# Altium schematic sheet CTRL_Connectors.SchDoc
size A4; SheetNumber: 4; SheetTotal: 15
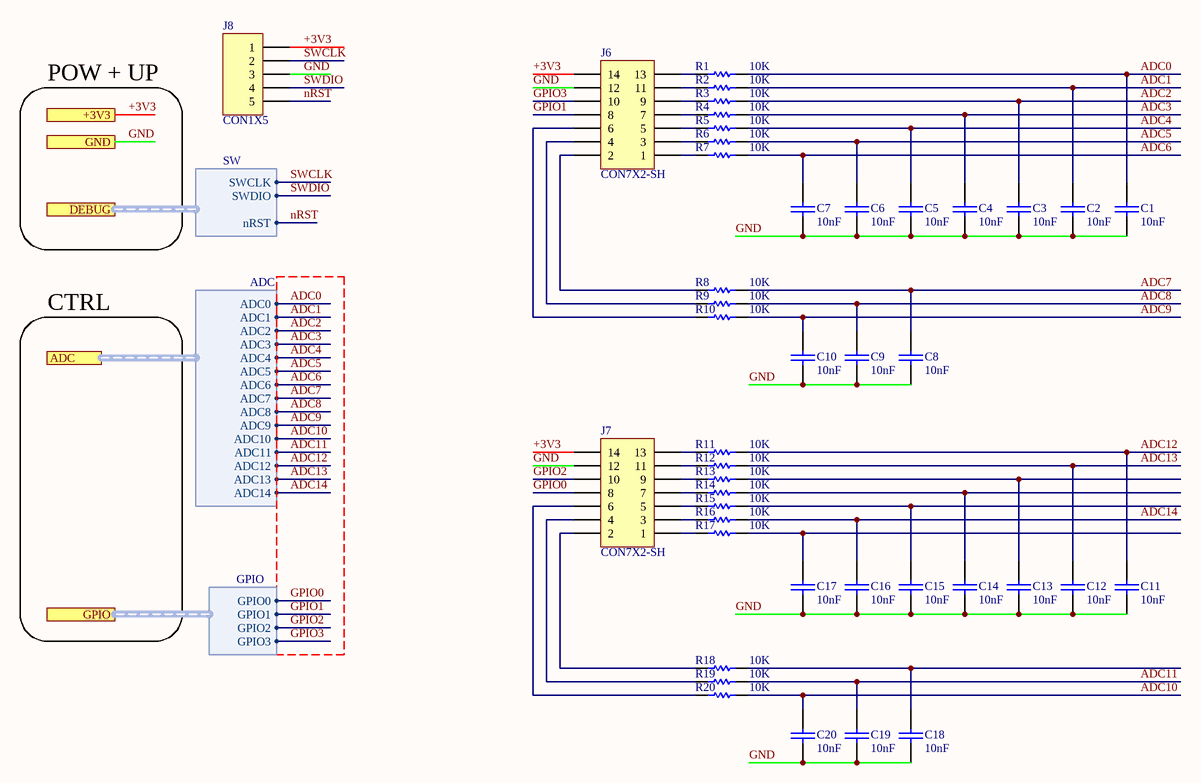
[diagram p0: CTRL_Connectors.SchDoc]

## Parts
C1  10nF  [0402-CAP-TDK]
C2  10nF  [0402-CAP-TDK]
C3  10nF  [0402-CAP-TDK]
C4  10nF  [0402-CAP-TDK]
C5  10nF  [0402-CAP-TDK]
C6  10nF  [0402-CAP-TDK]
C7  10nF  [0402-CAP-TDK]
C8  10nF  [0402-CAP-TDK]
C9  10nF  [0402-CAP-TDK]
C10  10nF  [0402-CAP-TDK]
C11  10nF  [0402-CAP-TDK]
C12  10nF  [0402-CAP-TDK]
C13  10nF  [0402-CAP-TDK]
C14  10nF  [0402-CAP-TDK]
C15  10nF  [0402-CAP-TDK]
C16  10nF  [0402-CAP-TDK]
C17  10nF  [0402-CAP-TDK]
C18  10nF  [0402-CAP-TDK]
C19  10nF  [0402-CAP-TDK]
C20  10nF  [0402-CAP-TDK]
J6  CON7X2-SH  [SIP7X2-SH]
J7  CON7X2-SH  [SIP7X2-SH]
J8  CON1X5  [SIP1X5]
R1  10K  [0402-RES-PANASONIC]
R2  10K  [0402-RES-PANASONIC]
R3  10K  [0402-RES-PANASONIC]
R4  10K  [0402-RES-PANASONIC]
R5  10K  [0402-RES-PANASONIC]
R6  10K  [0402-RES-PANASONIC]
R7  10K  [0402-RES-PANASONIC]
R8  10K  [0402-RES-PANASONIC]
R9  10K  [0402-RES-PANASONIC]
R10  10K  [0402-RES-PANASONIC]
R11  10K  [0402-RES-PANASONIC]
R12  10K  [0402-RES-PANASONIC]
R13  10K  [0402-RES-PANASONIC]
R14  10K  [0402-RES-PANASONIC]
R15  10K  [0402-RES-PANASONIC]
R16  10K  [0402-RES-PANASONIC]
R17  10K  [0402-RES-PANASONIC]
R18  10K  [0402-RES-PANASONIC]
R19  10K  [0402-RES-PANASONIC]
R20  10K  [0402-RES-PANASONIC]

## Ports
+3V3, ADC (harness ADC), DEBUG (harness SW), GND, GPIO (harness GPIO)

## Harnesses
SW: SWCLK, SWDIO, nRST
ADC: ADC0, ADC1, ADC2, ADC3, ADC4, ADC5, ADC6, ADC7, ADC8, ADC9, ADC10, ADC11, ADC12, ADC13, ADC14
GPIO: GPIO0, GPIO1, GPIO2, GPIO3

## Nets
+3V3: J6.14 J7.14 J8.1 ; port +3V3
ADC0: C1.2 R1.2 ; port ADC.ADC0
ADC1: C2.2 R2.2 ; port ADC.ADC1
ADC2: C3.2 R3.2 ; port ADC.ADC2
ADC3: C4.2 R4.2 ; port ADC.ADC3
ADC4: C5.2 R5.2 ; port ADC.ADC4
ADC5: C6.2 R6.2 ; port ADC.ADC5
ADC6: C7.2 R7.2 ; port ADC.ADC6
ADC7: C8.2 R8.2 ; port ADC.ADC7
ADC8: C9.2 R9.2 ; port ADC.ADC8
ADC9: C10.2 R10.2 ; port ADC.ADC9
ADC10: C20.2 R20.2 ; port ADC.ADC10
ADC11: C19.2 R19.2 ; port ADC.ADC11
ADC12: C11.2 R11.2 ; port ADC.ADC12
ADC13: C12.2 R12.2 ; port ADC.ADC13
ADC14: C16.2 R16.2 ; port ADC.ADC14
GND: C1.1 C2.1 C3.1 C4.1 C5.1 C6.1 C7.1 C8.1 C9.1 C10.1 C11.1 C12.1 C13.1 C14.1 C15.1 C16.1 C17.1 C18.1 C19.1 C20.1 J6.12 J7.12 J8.3 ; port GND
GPIO0: J7.8 ; port GPIO.GPIO0
GPIO1: J6.8 ; port GPIO.GPIO1
GPIO2: J7.10 ; port GPIO.GPIO2
GPIO3: J6.10 ; port GPIO.GPIO3
nRST: J8.5 ; port DEBUG.nRST
SWCLK: J8.2 ; port DEBUG.SWCLK
SWDIO: J8.4 ; port DEBUG.SWDIO
NetC13_2: C13.2 R13.2
NetC14_2: C14.2 R14.2
NetC15_2: C15.2 R15.2
NetC17_2: C17.2 R17.2
NetC18_2: C18.2 R18.2
NetJ6_1: J6.1 R7.1
NetJ6_2: J6.2 R8.1
NetJ6_3: J6.3 R6.1
NetJ6_4: J6.4 R9.1
NetJ6_5: J6.5 R5.1
NetJ6_6: J6.6 R10.1
NetJ6_7: J6.7 R4.1
NetJ6_9: J6.9 R3.1
NetJ6_11: J6.11 R2.1
NetJ6_13: J6.13 R1.1
NetJ7_1: J7.1 R17.1
NetJ7_2: J7.2 R18.1
NetJ7_3: J7.3 R16.1
NetJ7_4: J7.4 R19.1
NetJ7_5: J7.5 R15.1
NetJ7_6: J7.6 R20.1
NetJ7_7: J7.7 R14.1
NetJ7_9: J7.9 R13.1
NetJ7_11: J7.11 R12.1
NetJ7_13: J7.13 R11.1

## Notes on the sheet
- POW + UP
- CTRL

## Library data of the parts
C1-C20 = CAP-SMD: JLCPart: C15195
J6 J7 = CON7X2-SH: Connector Header Through Hole 14 position 0.100" (2.54mm)
R1-R20 = RES-SMD: JLCPart: C25744